# EAGLE design BatterySwitchBoard_2S1P (EAGLE 9.6.2)
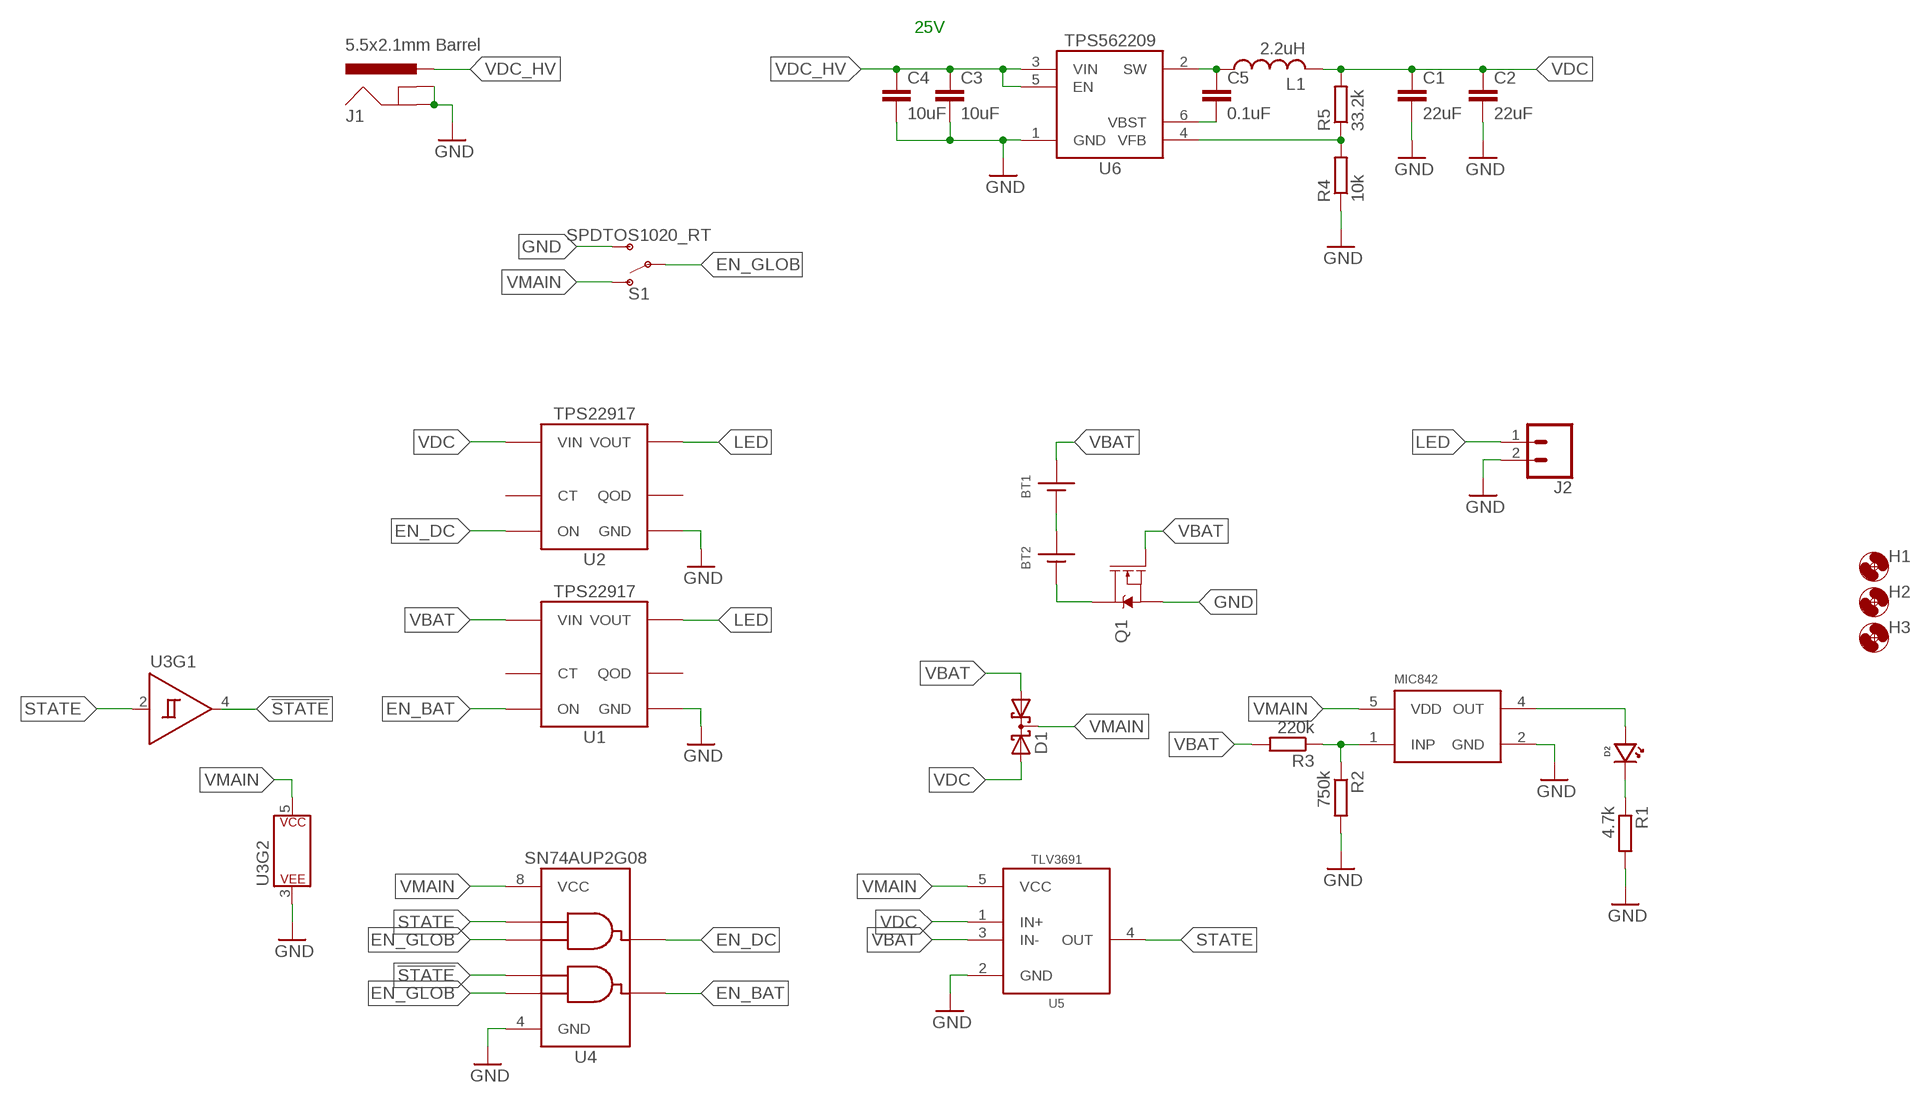
[diagram p0: schematic, sheet 1]

## Parts
BT1  AACLIP  [BAT_AA]
BT2  AACLIP  [BAT_AA]
C1  22uF  C-EU22UFC0805  [C0805]
C2  22uF  C-EU22UFC0805  [C0805]
C3  10uF  C-EU10UFC0805  [C0805]
C4  10uF  C-EU10UFC0805  [C0805]
C5  0.1uF  C-EU0.1UFC0603  [C0603]
D1  DIODE_CCBAT54CSOT23  [SOT23-3]
D2  LED0603  [LED_0603]
H1  MOUNTING_HOLE4_NP  [4_40]
H2  MOUNTING_HOLE4_NP  [4_40]
H3  MOUNTING_HOLE4_NP  [4_40]
J1  5.5x2.1mm Barrel  POWER_JACKSMD  [POWER_JACK_SMD]
J2  CONN_023.5MM_ROUND_RESTRICT  [SCREWTERMINAL-3.5MM-2_ROUND_RESTRICT]
L1  2.2uH  INDUCTOR1008  [1008]
Q1  DMG3404  MOSFET-NCH-DMG3404L  [SOT23-3]
R1  4.7k  R-EU_4.7KR0603  [R0603]
R2  750k  R-EU_750KR0603  [R0603]
R3  220k  R-EU_220KR0603  [R0603]
R4  10k  R-EU_10KR0603  [R0603]
R5  33.2k  R-EU_33.2KR0603  [R0603]
S1  SPDTOS1020_RT  [OS102011MA1QN1]
U1  TPS22917DBV  [DBV_R-PDSO-G6]
U2  TPS22917DBV  [DBV_R-PDSO-G6]
U3  SN74AUP1G14DCK  [DCK_R-PDSO-G5]
U4  SN74AUP2G08DCU  [DCU_(S-PDSO-G8)]
U5  TLV3691DCK  [DCK_R-PDSO-G5]
U6  TPS56209  [DDC_R-PDSO-G6]
U7  MIC842L  [DCK_R-PDSO-G5]

## Nets
!STATE: U3.4(Y) U4.5(A2)
EN_BAT: U1.3(ON) U4.3(Y2)
EN_DC: U2.3(ON) U4.7(Y1)
EN_GLOB: S1.2(P) U4.2(B1) U4.6(B2)
GND: C1.2 C2.2 C3.2 C4.2 J1.GND(GNDBREAK) J1.P$4(GND) J2.2 Q1.2(S) R1.2 R2.2 R4.1 S1.3(S) U1.2(GND) U2.2(GND) U3.3(P$V-) U4.4(GND) U5.2(GND) U6.1(GND) U7.2(GND)
LED: J2.1 U1.6(VOUT) U2.6(VOUT)
N$1: BT1.NEG@1(-) BT1.NEG@2(-) BT2.POS@1(+) BT2.POS@2(+)
N$2: R2.1 R3.1 U7.1(INP)
N$3: BT2.NEG@1(-) BT2.NEG@2(-) Q1.3(D)
N$4: D2.ANODE U7.4(OUT)
N$5: C5.1 L1.1 U6.2(SW)
N$6: D2.CATHODE R1.1
N$7: C5.2 U6.6(VBST)
N$8: R4.2 R5.1 U6.4(VFB)
STATE: U3.2(A) U4.1(A1) U5.4(OUT)
VBAT: BT1.POS@1(+) BT1.POS@2(+) D1.1(A1) Q1.1(G) R3.2 U1.1(VIN) U5.3(IN-)
VDC: C1.1 C2.1 D1.2(A2) L1.2 R5.2 U2.1(VIN) U5.1(IN+)
VDC_HV: C3.1 C4.1 J1.VIN0(PWR) U6.3(VIN) U6.5(EN)
VMAIN: D1.3(C) S1.1(O) U3.5(P$V+) U4.8(VCC) U5.5(VCC) U7.5(VDD)
Unconnected: U1.4(CT) U2.4(CT)

## Notes on the sheet
- 25V

## Power pins joined to a net without a drawn wire
QOD: U1.5(QOD) U2.5(QOD)

## Library data of the parts
BT1 BT2 = bschulz:AA: AA Battery Holder/Contact; DIGIKEY: BK-92-ND; MF: MPD; MPN: BK-92
C1 C2 = bschulz_passives:C-EU: CAPACITOR, European symbol; DIGIKEY: 490-9952-1-ND; MF: Murata; MPN: GRM219R61C226ME15L
C3 C4 = bschulz_passives:C-EU: CAPACITOR, European symbol; DIGIKEY: 490-6473-6-ND; MF: Murata; MPN: GRM21BR61C106KE15K
C5 = bschulz_passives:C-EU: CAPACITOR, European symbol; DIGIKEY: 490-6051-1-ND; MF: Murata; MPN: GCM188R71E104KA57D
D1 = bschulz:DIODE_CC: Dual Diode, Common Cathode BAT54C Vr, max: 30V Iavg: 200mA Vf: 800mv @ 100mA Reverse Leakage: 2μA @ 25V SDM40E20LC Vr, max: 20V Iavg: 400mA Vf: 310mv @ 100mA Reverse Leakage: 250μA @ 20V; DIGIKEY: BAT54CLT1GOSCT-ND; MF: ON Semiconductor; MPN: BAT54CLT1G
D2 = bschulz:LED: Genaric LED
H1-H3 = bschulz:MOUNTING_HOLE: Genaric Mechanical Mounting Hole Hole diameter based on max body diameter + 15% Keepout ring is for diameter of socket cap screw (minimum required clearance) TPlace ring is for diameter of pan head screw (recomended clearance) Specifications: Socket Cap <http://fastener-express.com/fastener-technical/SocketscapSS-Alloy.pdf> Button Head Socket Cap <http://fastener-express.com/fastener-technical/Button-Socket-alloy.pdf> Pan Head <http://fastener-express.com/fastener-technical/pan-machine-Screws.pdf>; DIGIKEY: DNP; MF: N/A; MPN: DNP
J1 = bschulz:POWER_JACK: Power Jack Connector This is the standard 5.5mm barrel jack for power. The PTH is the most common, proven, reliable, footprint. The Slot footprint only works if the mill layer is transmitted to the PCB fab house so be warned. Here are the connectors we sell at SparkFun: DC Barrel Power Jack/Connector <https://www.sparkfun.com/products/119> (PRT-00119) DC Barrel Power Jack/Connector (SMD) <https://www.sparkfun.com/products/12748> (PRT-12748) DC Barrel Jack Adapter - Breadboard Compatible <https://www.sparkfun.com/products/10811> (PRT-10811) It is used on this SparkFun product (and many, many others): SparkFun RedBoard - Programmed with Arduino <https://www.sparkfun.com/products/12757> (DEV-12757) Also, if you need a mating power supply or connector, please check these out: Wall Adapter Power Supply - 9VDC 650mA <https://www.sparkfun.com/products/298> (TOL-00298) DC Barrel Jack Adapter - Male <https://www.sparkfun.com/products/10287> (PRT-10287); DIGIKEY: 732-5929-1-ND; MF: Wurth; MPN: 694106106102
J2 = bschulz:CONN_02: Genaric 2 terminal header SCREW_2.54 <https://www.digikey.com/product-detail/en/on-shore-technology-inc/OSTVN02A150/ED10561-ND/1588862> 39532_RA <https://www.digikey.com/product-detail/en/molex/0395321002/WM7845-ND/1280696>; DIGIKEY: ED2635-ND; MF: On Shore; MPN: OSTTE020161
L1 = bschulz:INDUCTOR: Genaric inductor
Q1 = bschulz:MOSFET-NCH: N-channel MOSFETs Voltage controlled devices that allow control of high current outputs. SparkFun Products: SparkFun OpenScale <https://www.sparkfun.com/products/13261> SparkFun Digital Sandbox <https://www.sparkfun.com/products/12651> SparkFun Monster Moto Shield <https://www.sparkfun.com/products/10182> SparkFun MOSFET Power Controller <https://www.sparkfun.com/products/11214>; DIGIKEY: DMG3404L-7DICT-ND; MF: Diodes Incorporated; MPN: DMG3404L-7
R1 = bschulz_passives:R-EU_: RESISTOR, European symbol Digikey Parts: Yageo, 0402 <https://www.digikey.com/products/en/resistors/chip-resistor-surface-mount/52?k=&pkeyword=&sv=0&s=4356&sf=1&FV=-1%7C13%2C7%7C2%2C1291%7C39157%2C1989%7C0%2C-8%7C52%2C3%7C1131%2C3%7C2503&quantity=&ColumnSort=0&page=1&stock=1&pageSize=25> Yageo, 0603 <https://www.digikey.com/products/en/resistors/chip-resistor-surface-mount/52?k=&pkeyword=&sv=0&pv1291=39245&sf=1&FV=-5%7C4356%2C-5%7C47360%2C-8%7C52%2C-1%7C13%2C7%7C2%2C1989%7C0&quantity=10&ColumnSort=1000011&page=1&stock=1&pageSize=25> Panasonic, 0603 <https://www.digikey.com/products/en/resistors/chip-resistor-surface-mount/52?k=&pkeyword=&pv252=68&sf=0&FV=ffec373d%2C1c0002%2C142c040c%2C1f140000%2Cffe00034%2C80002%2Cc0001&quantity=&ColumnSort=0&page=1&stock=1&pageSize=25> Panasonic, precision, 0603 <https://www.digikey.com/products/en/resistors/chip-resistor-surface-mount/52?FV=ffec4907%2Cfffc000a%2Cc0172%2C142c040c%2C1f140000%2Cffe00034%2C1c0002&quantity=100&ColumnSort=2085&page=1&stock=1&pageSize=25> Panasonic, 0805 <https://www.digikey.com/products/en/resistors/chip-resistor-surface-mount/52?k=&pkeyword=&pv3=1&sf=0&FV=ffec373d%2C1c0002%2C1f140000%2Cffe00034%2C142c040d&quantity=&ColumnSort=0&page=1&stock=1&pageSize=25> Rohm, current sense <https://www.digikey.com/products/en/resistors/chip-resistor-surface-mount/52?k=&pkeyword=&pv3=1&sf=0&FV=ffecb688%2C1f140000%2Cffe00034%2C1c0002&quantity=&ColumnSort=0&page=1&stock=1&pageSize=25> Vishay, pulse proof automotive <https://www.digikey.com/products/en/resistors/chip-resistor-surface-mount/52?k=&pkeyword=&pv7=2&sf=0&FV=ffec5d6b%2Cffe00034%2C1f140000&quantity=&ColumnSort=0&page=1&stock=1&pageSize=25>; DIGIKEY: 311-4.70KHRCT-ND; MF: Yageo; MPN: RC0603FR-074K7L; VALUE_PART: 4.7k
R2 = bschulz_passives:R-EU_: RESISTOR, European symbol Digikey Parts: Yageo, 0402 <https://www.digikey.com/products/en/resistors/chip-resistor-surface-mount/52?k=&pkeyword=&sv=0&s=4356&sf=1&FV=-1%7C13%2C7%7C2%2C1291%7C39157%2C1989%7C0%2C-8%7C52%2C3%7C1131%2C3%7C2503&quantity=&ColumnSort=0&page=1&stock=1&pageSize=25> Yageo, 0603 <https://www.digikey.com/products/en/resistors/chip-resistor-surface-mount/52?k=&pkeyword=&sv=0&pv1291=39245&sf=1&FV=-5%7C4356%2C-5%7C47360%2C-8%7C52%2C-1%7C13%2C7%7C2%2C1989%7C0&quantity=10&ColumnSort=1000011&page=1&stock=1&pageSize=25> Panasonic, 0603 <https://www.digikey.com/products/en/resistors/chip-resistor-surface-mount/52?k=&pkeyword=&pv252=68&sf=0&FV=ffec373d%2C1c0002%2C142c040c%2C1f140000%2Cffe00034%2C80002%2Cc0001&quantity=&ColumnSort=0&page=1&stock=1&pageSize=25> Panasonic, precision, 0603 <https://www.digikey.com/products/en/resistors/chip-resistor-surface-mount/52?FV=ffec4907%2Cfffc000a%2Cc0172%2C142c040c%2C1f140000%2Cffe00034%2C1c0002&quantity=100&ColumnSort=2085&page=1&stock=1&pageSize=25> Panasonic, 0805 <https://www.digikey.com/products/en/resistors/chip-resistor-surface-mount/52?k=&pkeyword=&pv3=1&sf=0&FV=ffec373d%2C1c0002%2C1f140000%2Cffe00034%2C142c040d&quantity=&ColumnSort=0&page=1&stock=1&pageSize=25> Rohm, current sense <https://www.digikey.com/products/en/resistors/chip-resistor-surface-mount/52?k=&pkeyword=&pv3=1&sf=0&FV=ffecb688%2C1f140000%2Cffe00034%2C1c0002&quantity=&ColumnSort=0&page=1&stock=1&pageSize=25> Vishay, pulse proof automotive <https://www.digikey.com/products/en/resistors/chip-resistor-surface-mount/52?k=&pkeyword=&pv7=2&sf=0&FV=ffec5d6b%2Cffe00034%2C1f140000&quantity=&ColumnSort=0&page=1&stock=1&pageSize=25>; DIGIKEY: 311-750KHRCT-ND; MF: Yageo; MPN: RC0603FR-07750KL; VALUE_PART: 750k
R3 = bschulz_passives:R-EU_: RESISTOR, European symbol Digikey Parts: Yageo, 0402 <https://www.digikey.com/products/en/resistors/chip-resistor-surface-mount/52?k=&pkeyword=&sv=0&s=4356&sf=1&FV=-1%7C13%2C7%7C2%2C1291%7C39157%2C1989%7C0%2C-8%7C52%2C3%7C1131%2C3%7C2503&quantity=&ColumnSort=0&page=1&stock=1&pageSize=25> Yageo, 0603 <https://www.digikey.com/products/en/resistors/chip-resistor-surface-mount/52?k=&pkeyword=&sv=0&pv1291=39245&sf=1&FV=-5%7C4356%2C-5%7C47360%2C-8%7C52%2C-1%7C13%2C7%7C2%2C1989%7C0&quantity=10&ColumnSort=1000011&page=1&stock=1&pageSize=25> Panasonic, 0603 <https://www.digikey.com/products/en/resistors/chip-resistor-surface-mount/52?k=&pkeyword=&pv252=68&sf=0&FV=ffec373d%2C1c0002%2C142c040c%2C1f140000%2Cffe00034%2C80002%2Cc0001&quantity=&ColumnSort=0&page=1&stock=1&pageSize=25> Panasonic, precision, 0603 <https://www.digikey.com/products/en/resistors/chip-resistor-surface-mount/52?FV=ffec4907%2Cfffc000a%2Cc0172%2C142c040c%2C1f140000%2Cffe00034%2C1c0002&quantity=100&ColumnSort=2085&page=1&stock=1&pageSize=25> Panasonic, 0805 <https://www.digikey.com/products/en/resistors/chip-resistor-surface-mount/52?k=&pkeyword=&pv3=1&sf=0&FV=ffec373d%2C1c0002%2C1f140000%2Cffe00034%2C142c040d&quantity=&ColumnSort=0&page=1&stock=1&pageSize=25> Rohm, current sense <https://www.digikey.com/products/en/resistors/chip-resistor-surface-mount/52?k=&pkeyword=&pv3=1&sf=0&FV=ffecb688%2C1f140000%2Cffe00034%2C1c0002&quantity=&ColumnSort=0&page=1&stock=1&pageSize=25> Vishay, pulse proof automotive <https://www.digikey.com/products/en/resistors/chip-resistor-surface-mount/52?k=&pkeyword=&pv7=2&sf=0&FV=ffec5d6b%2Cffe00034%2C1f140000&quantity=&ColumnSort=0&page=1&stock=1&pageSize=25>; DIGIKEY: 311-220KHRCT-ND; MF: Yageo; MPN: RC0603FR-07220KL; VALUE_PART: 220k
R4 = bschulz_passives:R-EU_: RESISTOR, European symbol Digikey Parts: Yageo, 0402 <https://www.digikey.com/products/en/resistors/chip-resistor-surface-mount/52?k=&pkeyword=&sv=0&s=4356&sf=1&FV=-1%7C13%2C7%7C2%2C1291%7C39157%2C1989%7C0%2C-8%7C52%2C3%7C1131%2C3%7C2503&quantity=&ColumnSort=0&page=1&stock=1&pageSize=25> Yageo, 0603 <https://www.digikey.com/products/en/resistors/chip-resistor-surface-mount/52?k=&pkeyword=&sv=0&pv1291=39245&sf=1&FV=-5%7C4356%2C-5%7C47360%2C-8%7C52%2C-1%7C13%2C7%7C2%2C1989%7C0&quantity=10&ColumnSort=1000011&page=1&stock=1&pageSize=25> Panasonic, 0603 <https://www.digikey.com/products/en/resistors/chip-resistor-surface-mount/52?k=&pkeyword=&pv252=68&sf=0&FV=ffec373d%2C1c0002%2C142c040c%2C1f140000%2Cffe00034%2C80002%2Cc0001&quantity=&ColumnSort=0&page=1&stock=1&pageSize=25> Panasonic, precision, 0603 <https://www.digikey.com/products/en/resistors/chip-resistor-surface-mount/52?FV=ffec4907%2Cfffc000a%2Cc0172%2C142c040c%2C1f140000%2Cffe00034%2C1c0002&quantity=100&ColumnSort=2085&page=1&stock=1&pageSize=25> Panasonic, 0805 <https://www.digikey.com/products/en/resistors/chip-resistor-surface-mount/52?k=&pkeyword=&pv3=1&sf=0&FV=ffec373d%2C1c0002%2C1f140000%2Cffe00034%2C142c040d&quantity=&ColumnSort=0&page=1&stock=1&pageSize=25> Rohm, current sense <https://www.digikey.com/products/en/resistors/chip-resistor-surface-mount/52?k=&pkeyword=&pv3=1&sf=0&FV=ffecb688%2C1f140000%2Cffe00034%2C1c0002&quantity=&ColumnSort=0&page=1&stock=1&pageSize=25> Vishay, pulse proof automotive <https://www.digikey.com/products/en/resistors/chip-resistor-surface-mount/52?k=&pkeyword=&pv7=2&sf=0&FV=ffec5d6b%2Cffe00034%2C1f140000&quantity=&ColumnSort=0&page=1&stock=1&pageSize=25>; DIGIKEY: 311-10.0KHRCT-ND; MF: Yageo; MPN: RC0603FR-0710KL; VALUE_PART: 10k
R5 = bschulz_passives:R-EU_: RESISTOR, European symbol Digikey Parts: Yageo, 0402 <https://www.digikey.com/products/en/resistors/chip-resistor-surface-mount/52?k=&pkeyword=&sv=0&s=4356&sf=1&FV=-1%7C13%2C7%7C2%2C1291%7C39157%2C1989%7C0%2C-8%7C52%2C3%7C1131%2C3%7C2503&quantity=&ColumnSort=0&page=1&stock=1&pageSize=25> Yageo, 0603 <https://www.digikey.com/products/en/resistors/chip-resistor-surface-mount/52?k=&pkeyword=&sv=0&pv1291=39245&sf=1&FV=-5%7C4356%2C-5%7C47360%2C-8%7C52%2C-1%7C13%2C7%7C2%2C1989%7C0&quantity=10&ColumnSort=1000011&page=1&stock=1&pageSize=25> Panasonic, 0603 <https://www.digikey.com/products/en/resistors/chip-resistor-surface-mount/52?k=&pkeyword=&pv252=68&sf=0&FV=ffec373d%2C1c0002%2C142c040c%2C1f140000%2Cffe00034%2C80002%2Cc0001&quantity=&ColumnSort=0&page=1&stock=1&pageSize=25> Panasonic, precision, 0603 <https://www.digikey.com/products/en/resistors/chip-resistor-surface-mount/52?FV=ffec4907%2Cfffc000a%2Cc0172%2C142c040c%2C1f140000%2Cffe00034%2C1c0002&quantity=100&ColumnSort=2085&page=1&stock=1&pageSize=25> Panasonic, 0805 <https://www.digikey.com/products/en/resistors/chip-resistor-surface-mount/52?k=&pkeyword=&pv3=1&sf=0&FV=ffec373d%2C1c0002%2C1f140000%2Cffe00034%2C142c040d&quantity=&ColumnSort=0&page=1&stock=1&pageSize=25> Rohm, current sense <https://www.digikey.com/products/en/resistors/chip-resistor-surface-mount/52?k=&pkeyword=&pv3=1&sf=0&FV=ffecb688%2C1f140000%2Cffe00034%2C1c0002&quantity=&ColumnSort=0&page=1&stock=1&pageSize=25> Vishay, pulse proof automotive <https://www.digikey.com/products/en/resistors/chip-resistor-surface-mount/52?k=&pkeyword=&pv7=2&sf=0&FV=ffec5d6b%2Cffe00034%2C1f140000&quantity=&ColumnSort=0&page=1&stock=1&pageSize=25>; DIGIKEY: 311-33.2KHRCT-ND; MF: Yageo; MPN: RC0603FR-0733K2L; VALUE_PART: 33.2k
S1 = bschulz:SPDT: Genaric SPDT switch; DIGIKEY: CKN9559-ND; MF: C&K; MPN: OS102011MA1QN1
U1 U2 = bschulz:TPS22917: TPS22917 - Ultra Low Leakage Load Switch Characteristics: Vin: 1v ~ 5.5v IQ: 10nA (OFF), 0.5μA (ON) RDS(ON): 80mΩ (Vin = 5v), 90mΩ (Vin = 3.3v) Output Current: 2A Operating Temperature: -40°C to 125°C Digikey: 296-48370-1-ND <https://www.digikey.com/product-detail/en/texas-instruments/TPS22917DBVT/296-48370-1-ND/8567102>; DIGIKEY: 296-48370-1-ND; MF: TI; MPN: TPS22917DBVT
U3 = bschulz:SN74*1G14: SN74x1G14 - Single Schmitt Triger Inverter Characteristics: VCC: 0.8 ~ 3.6V (1.65 ~ 5.5V for LVC Version) Operating Temperature: -40°C to 85°C (-40°C to 125°C for LVC Version) fmax = 2.5 MHz (for Vcc =1.65v, high for higher Vcc) Output Current = ± 4 mA (± 32 mA for LVC Version) Digikey: 296-19076-1-ND (AUP Low Voltage) <https://www.digikey.com/product-detail/en/texas-instruments/SN74AUP1G14DCKR/296-19076-1-ND/864307> 296-47215-1-ND (LVC High Voltage) <https://www.digikey.com/product-detail/en/texas-instruments/SN74LVC1G14DCKR/296-11608-1-ND/385747>; DIGIKEY: 296-19076-1-ND; MF: TI; MPN: SN74AUP1G14DCKR
U4 = bschulz:SN74AUP2G08: SN74AUP2G08 - AND, 2 Element, 2 Input Characteristics: VCC: 0.8 ~ 3.6v IQ = 0.9μA Operating Temperature: -40°C to 85°C Digikey: 296-25638-1-ND (DQE) <https://www.digikey.com/product-detail/en/texas-instruments/SN74AUP2G08DQER/296-25638-1-ND/2202460>; DIGIKEY: 296-32271-1-ND; MF: TI; MPN: SN74AUP2G08DCUR
U5 = bschulz:TLV3691: TLV3691 - Nanopower Analog Comparator Characteristics: Vin: 0.9V ~ 6.5V (± 0.45V ~ ± 3.25V) Response Time: 24us Push-Pull Output IQ: 75nA Operating Temperature: -40°C to 125°C Digikey: 296-37910-1-ND (DCK) <https://www.digikey.com/products/en/integrated-circuits-ics/linear-comparators/692?k=TLV3691&k=&pkeyword=TLV3691&sv=0&pv7=2&sf=0&FV=142c0371%2Cffe002b4&quantity=&ColumnSort=1000011&page=1&stock=1&pageSize=25> 296-37242-6-ND (DPF) <https://www.digikey.com/product-detail/en/texas-instruments/TLV3691IDPFR/296-37242-6-ND/4695352>; DIGIKEY: 296-37910-1-ND; MF: TI; MPN: TLV3691IDCKR
U6 = bschulz:TPS56*209: TPS563209/TPS562209 - High Efficiency Synchronous Boost Converter Characteristics: Vin: 4.5V ~ 17V Vout: 0.76V ~ 7V Output Current (max): 2A IQ: 650μA (typ) Operating Temperature: -40°C to 85°C Digikey: 296-37302-1-ND ( <https://www.digikey.com/product-detail/en/texas-instruments/TPS562209DDCT/296-37302-1-ND/4747946>; DIGIKEY: 296-37302-1-ND; DISP: TPS562209; MF: TI; MPN: TPS562209DDCT
U7 = bschulz:MIC842: Comparator with internal voltage referance (1.24V), 5V and 3.3V compatable, 20mA output current; DIGIKEY: 576-2927-1-ND; MF: Microchip; MPN: MIC842LYC5-TR

## Board
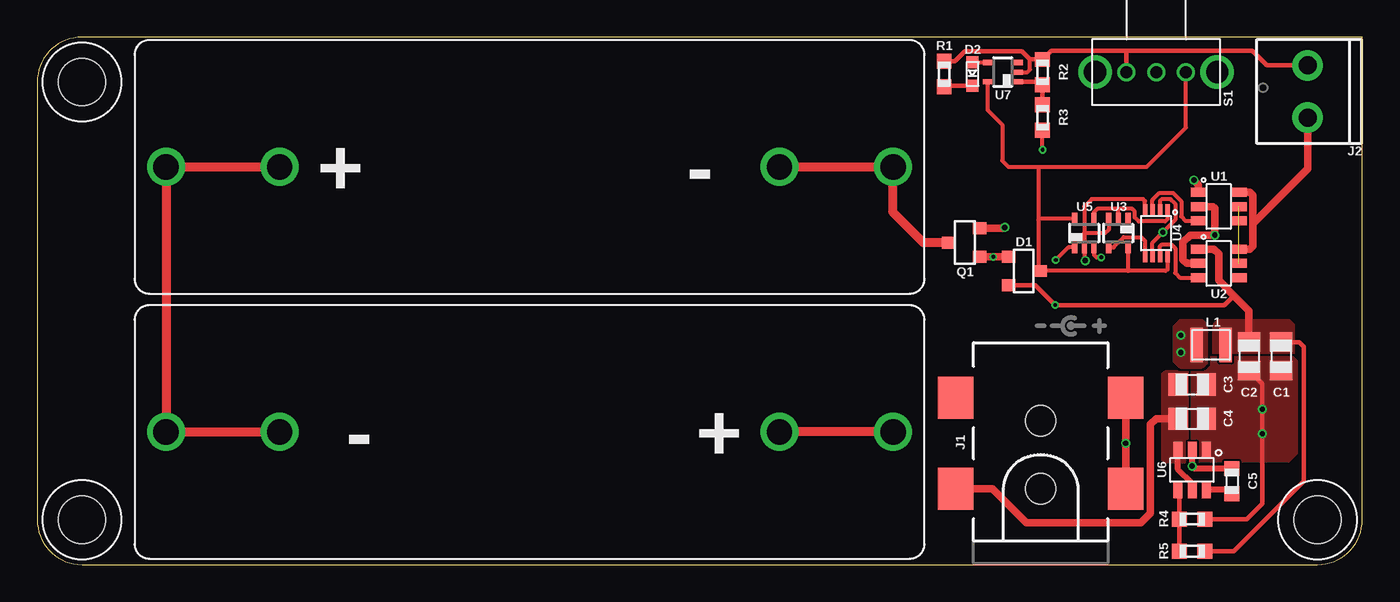
[diagram p1: board, top side]
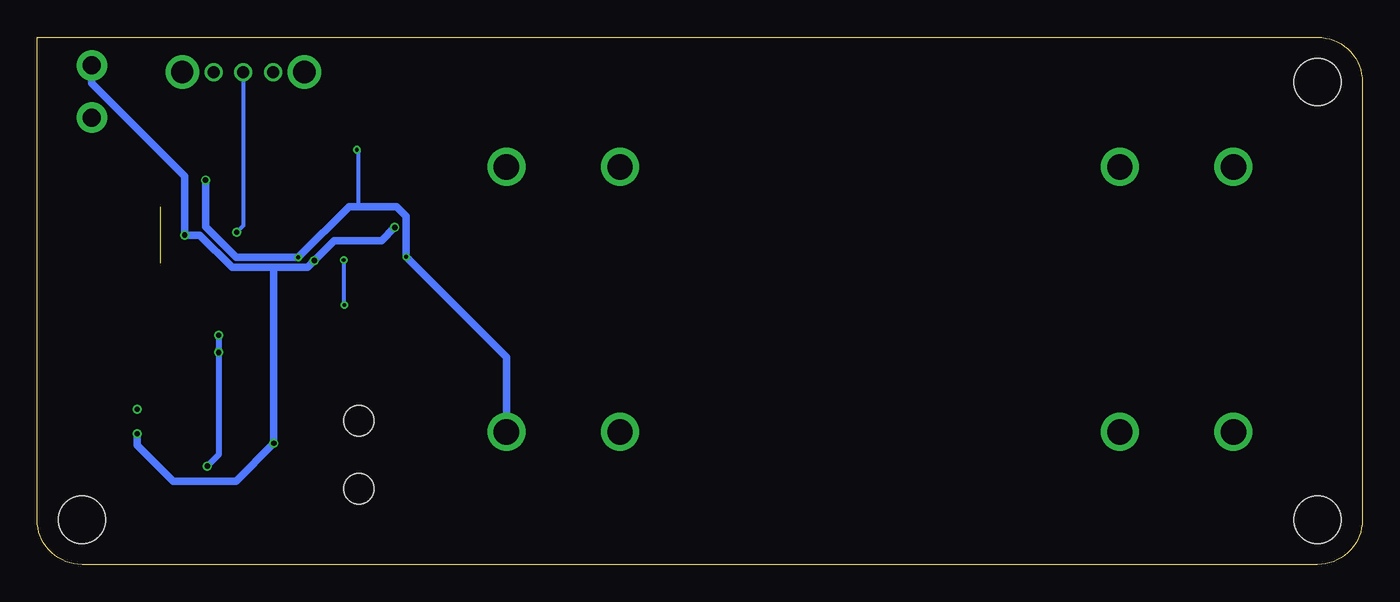
[diagram p2: board, bottom side, seen from below]

Size 88.88 x 35.36 mm. Coordinates in mm from the lower left corner, seen from the top.
Outline: 88.88,35.36 3,35.36 arc90 0,32.36 0,3 arc90 3,0 85.88,0 arc90 88.88,3 88.88,35.36
Copper layers (1*16): Top 0.035559375mm / dielectric 1.6mm / Bottom 0.035559375mm
Design rules "oshpark-2layer": minimum track width 6mil, minimum drill 10mil, track to track 6mil, track to pad 6mil, pad to pad 6mil, via to via 6mil, smd to smd 6mil, copper to edge 15mil, drill to drill 6mil, minimum pad ring 5mil, minimum via ring 5mil, stop-mask expansion 2.5mil, vias tented up to drill 0mil, thermal gap 10mil

### Footprints (pad centres in the part's own frame; a part is rotated, then mirrored left to right if it is on the bottom)
BAT_AA = drill 1.7: NEG@1 0,-16.765; NEG@2 0,-24.385; POS@1 0,24.385; POS@2 0,16.765
C0805 = smd 1.3 x 1.5: 1 -0.95,0; 2 0.95,0
C0603 = smd 1 x 1: 1 -0.85,0; 2 0.85,0
SOT23-3 = smd 0.8 x 0.9: 1 -0.95,-1; 2 0.95,-1; 3 0,1.1
LED_0603 = smd 0.8 x 0.8: ANODE 0.8,0; CATHODE -0.8,0
4_40 = hole 3.175: 0,0
POWER_JACK_SMD = smd 2.8 x 2.4: GND 0,-5.7; P$4 6.1,-5.7; VIN0 0,5.7; VIN1 6.1,5.7 | hole 2.032: 0,0; 4.572,0
SCREWTERMINAL-3.5MM-2_ROUND_RESTRICT = drill 1.2 pad 2.032: 1 0,0; 2 3.5,0
1008 = smd 0.85 x 2.3: 1 -0.975,0; 2 0.975,0
R0603 = smd 1 x 1: 1 -0.85,0; 2 0.85,0
OS102011MA1QN1 = drill 0.8: 1 -2,0; 2 0,0; 3 2,0 | drill 1.5: BODY@1 -4.1,0; BODY@2 4.1,0
DBV_R-PDSO-G6 = smd 0.6 x 1.05: 1 -0.95,-1.35; 2 0,-1.35; 3 0.95,-1.35; 4 0.95,1.35; 5 0,1.35; 6 -0.95,1.35
DCK_R-PDSO-G5 = smd 0.35 x 0.8: 1 -0.65,-0.95; 2 0,-0.95; 3 0.65,-0.95; 4 0.65,0.95; 5 -0.65,0.95
DCU_(S-PDSO-G8) = smd 0.8 x 0.3: 1 -1.55,0.75; 2 -1.55,0.25; 3 -1.55,-0.25; 4 -1.55,-0.75; 5 1.55,-0.75; 6 1.55,-0.25; 7 1.55,0.25; 8 1.55,0.75
DDC_R-PDSO-G6 = smd 0.6 x 1.1: 1 -0.95,-1.35; 2 0,-1.35; 3 0.95,-1.35; 4 0.95,1.35; 5 0,1.35; 6 -0.95,1.35

### Placement (x,y rotation side)
BT1  33.02,8.89 270 top
BT2  33.02,26.67 90 top
C1  83.44,13.97 270 top
C2  81.28,13.97 270 top
C3  77.47,12.06 0 top
C4  77.47,9.78 0 top
C5  80.14,5.59 270 top
D1  66.17,19.68 270 top
D2  62.74,32.89 90 top
H1  3,3 0 top
H2  3,32.36 0 top
H3  85.88,3 0 top
J1  67.31,5.08 90 top
J2  85.22,29.97 90 top
L1  78.74,14.73 0 top
Q1  62.23,21.59 90 top
R1  60.83,32.89 90 top
R2  67.44,33.02 90 top
R3  67.44,29.97 270 top
R4  77.47,3.05 180 top
R5  77.47,0.89 0 top
S1  75.06,33.02 180 top
U1  79.25,24 270 top
U2  79.25,20.19 270 top
U3  72.52,22.23 180 top
U4  75.06,22.23 270 top
U5  70.23,22.23 0 top
U6  77.47,6.35 180 top
U7  64.77,33.02 90 top

### Tracks (layer width: path | path; a pad name or v marks a point on that pad's centre or on a via)
!STATE
  Top 0.254: U3.4 72.2,21.27 72.88,21.95 74.06,21.95 74.31,21.7 U4.5
EN_BAT
  Top 0.254: U4.3 74.81,24.45 75.27,24.92 76.18,24.92 76.73,24.37 76.73,23.34 77.02,23.05 U1.3
EN_DC
  Top 0.254: U4.7 75.31,21.33 75.44,21.46 76.07,21.46 76.33,21.21 76.33,19.56 76.64,19.24 U2.3
EN_GLOB  (via drill 0.35)
  Top 0.254: U4.6 74.81,21.59 v75.5,22.29 76.33,23.11 76.33,24.2 76.02,24.51 75.44,24.51 75.31,24.38 U4.2
  Bottom 0.254: S1.2 75.06,22.73 v75.5,22.29
GND  (via drill 0.35)
  Top 0.254: U3.3 71.87,22.46 71.63,22.23 70.23,22.23 | U4.4 74.31,24.37 74.17,24.51 70.74,24.51 70.23,24 70.23,22.23 | 70.23,22.23 U5.2 70.23,20.45 v70.29,20.38 | U7.2 66.42,33.02 66.59,33.19 66.59,33.87
  Top 0.305: R4.1 81.15,3.05 82.17,4.06 v82.17,8.76 v82.17,10.41 82.17,12.13 C2.2 | R1.2 61.56,33.74 62.23,34.42 66.04,34.42 66.59,33.87 R2.2 68.02,34.45 73.03,34.45 | S1.3 73.06,34.42 73.03,34.45 | J2.2 82.48,33.47 81.5,34.45 73.03,34.45
  Top 0.508: U1.2 78.87,24 78.99,23.88 v78.99,22.1 77.34,22.1 76.86,21.61 76.86,20.45 77.11,20.19 U2.2 | J1.GND v73.01,8.13 J1.P$4 | Q1.2 64.83,22.54 v64.9,22.61
  Bottom 0.508: v82.17,8.76 82.17,8 79.76,5.59 75.55,5.59 v73.01,8.13 73.01,19.94 | J2.2 85.22,32.26 78.99,26.04 v78.99,22.1 77.98,22.1 75.82,19.94 73.01,19.94 | v64.9,22.61 65.79,21.72 68.96,21.72 v70.29,20.38 70.74,19.94 73.01,19.94
  pour Top (rank 2, no thermals): 84.45,7.49 84.45,13.59 84.2,13.84 78.11,13.84 77.47,13.21 77.47,7.24 77.72,6.99 83.95,6.99
LED
  Top 0.508: U2.6 81.34,21.14 81.53,21.34 81.53,22.86 | 81.53,22.86 81.53,24.77 81.35,24.95 U1.6 | J2.1 85.22,26.54 81.53,22.86
N$1
  Top 0.61: BT1.NEG@2 8.76,8.89 | 8.76,8.89 BT1.NEG@1 | 8.76,8.89 8.63,9.02 BT2.POS@1 BT2.POS@2
N$2
  Top 0.305: U7.1 67.24,32.37 R2.1 R3.1
N$3
  Top 0.61: BT2.NEG@1 BT2.NEG@2 57.41,23.62 59.44,21.59 Q1.3
N$4
  Top 0.254: D2.ANODE 63.8,33.69 U7.4
N$5  (via drill 0.35)
  Top 0.406: U6.2 v77.47,6.6 77.64,6.44 C5.1
  Bottom 0.406: v76.71,15.37 v76.71,14.22 76.71,7.37 v77.47,6.6
  pour Top (no thermals): 78.36,16 78.11,16.26 76.71,16.26 76.33,15.88 76.33,13.72 76.71,13.34 78.11,13.34 78.36,13.59
N$6
  Top 0.305: D2.CATHODE 60.88,32.09 R1.1
N$7
  Top 0.406: C5.2 79.88,5 U6.6
N$8
  Top 0.305: U6.4 76.62,4.9 R4.2 R5.1
QOD  (1 unrouted)
STATE
  Top 0.254: U4.1 75.81,23.17 75.66,23.02 73.88,23.02 73.62,23.28 73.62,23.69 73.46,23.85 72.52,23.85 | U5.4 70.88,23.64 71.1,23.85 72.52,23.85 | U3.2 72.52,23.85
VBAT  (via drill 0.25, 0.35)
  Top 0.254: U5.3 70.88,20.77 71.05,20.6 v71.37,20.6 | v67.44,27.81 R3.2
  Top 0.305: 63.28,20.59 Q1.1
  Top 0.508: Q1.1 v64.14,20.64 D1.1 | v77.6,25.78 77.9,25.48 U1.1
  Top 0.61: BT1.POS@1 BT1.POS@2
  Bottom 0.254: 67.31,24 67.31,27.69 v67.44,27.81
  Bottom 0.508: BT1.POS@1 57.41,13.9 v64.14,20.64 64.14,23.37 64.77,24 67.31,24 67.97,24 v71.37,20.6 75.55,20.6 77.6,22.65 v77.6,25.78
VDC  (via drill 0.25)
  Top 0.254: U5.1 69.18,21.27 v68.33,20.42
  Top 0.305: R5.2 80.26,0.89 84.96,5.59 84.96,14.61 84.65,14.92 C1.1 | 79.69,14.76 L1.2 | 80.26,18.03 79.63,17.4 v68.28,17.4 66.94,18.73 D1.2
  Top 0.508: C2.1 81.28,17.02 80.26,18.03 79.25,19.05 79.25,20.83 78.93,21.14 U2.1
  Bottom 0.254: v68.33,20.42 68.33,17.44 v68.28,17.4
  pour Top (rank 3, no thermals): 84.2,16 83.95,16.26 79.25,16.26 78.99,16 78.99,13.59 79.25,13.34 84.07,13.34 84.2,13.46
VDC_HV
  Top 0.406: U6.5 77.47,5.44 76.52,6.39 U6.3
  Top 0.508: J1.VIN0 64.08,5.08 66.36,2.79 74.04,2.79 74.68,3.43 74.68,9.4 75.06,9.78 C4.1
  pour Top (rank 3, no thermals): 77.09,12.83 75.69,12.83 75.56,12.7 75.56,7.11 75.69,6.99 76.96,6.99 77.09,7.11
VMAIN
  Top 0.254: U4.8 75.81,19.8 75.69,19.68 73.17,19.68 | U3.5 73.17,19.68 | 73.17,19.68 D1.3 67.14,19.81 67.14,23.11 | 67.14,26.67 67.14,23.11 | U7.5 63.75,32.3 63.75,30.48 64.73,29.51 64.73,27.09 65.15,26.67 67.14,26.67 | 67.14,26.67 74.42,26.67 77.06,29.3 S1.1 | U5.5 67.2,23.18 67.14,23.11

### Text on the board
tDocu: - | Low Bat | OFF | ON | + | LED | 5 ~ 12V / >250mA | Project Killdeer
bDocu: Project Killdeer / Bobby Schulz / v0.0